# Altium schematic sheet Tilt-Power.SchDoc
size A3; Author: Yaokun/Felix Zhang; Organization: Altium Limited; Address1: 21A144; Address2: Harbin Engineering University; Address3: Harbin; Address4: CHINA
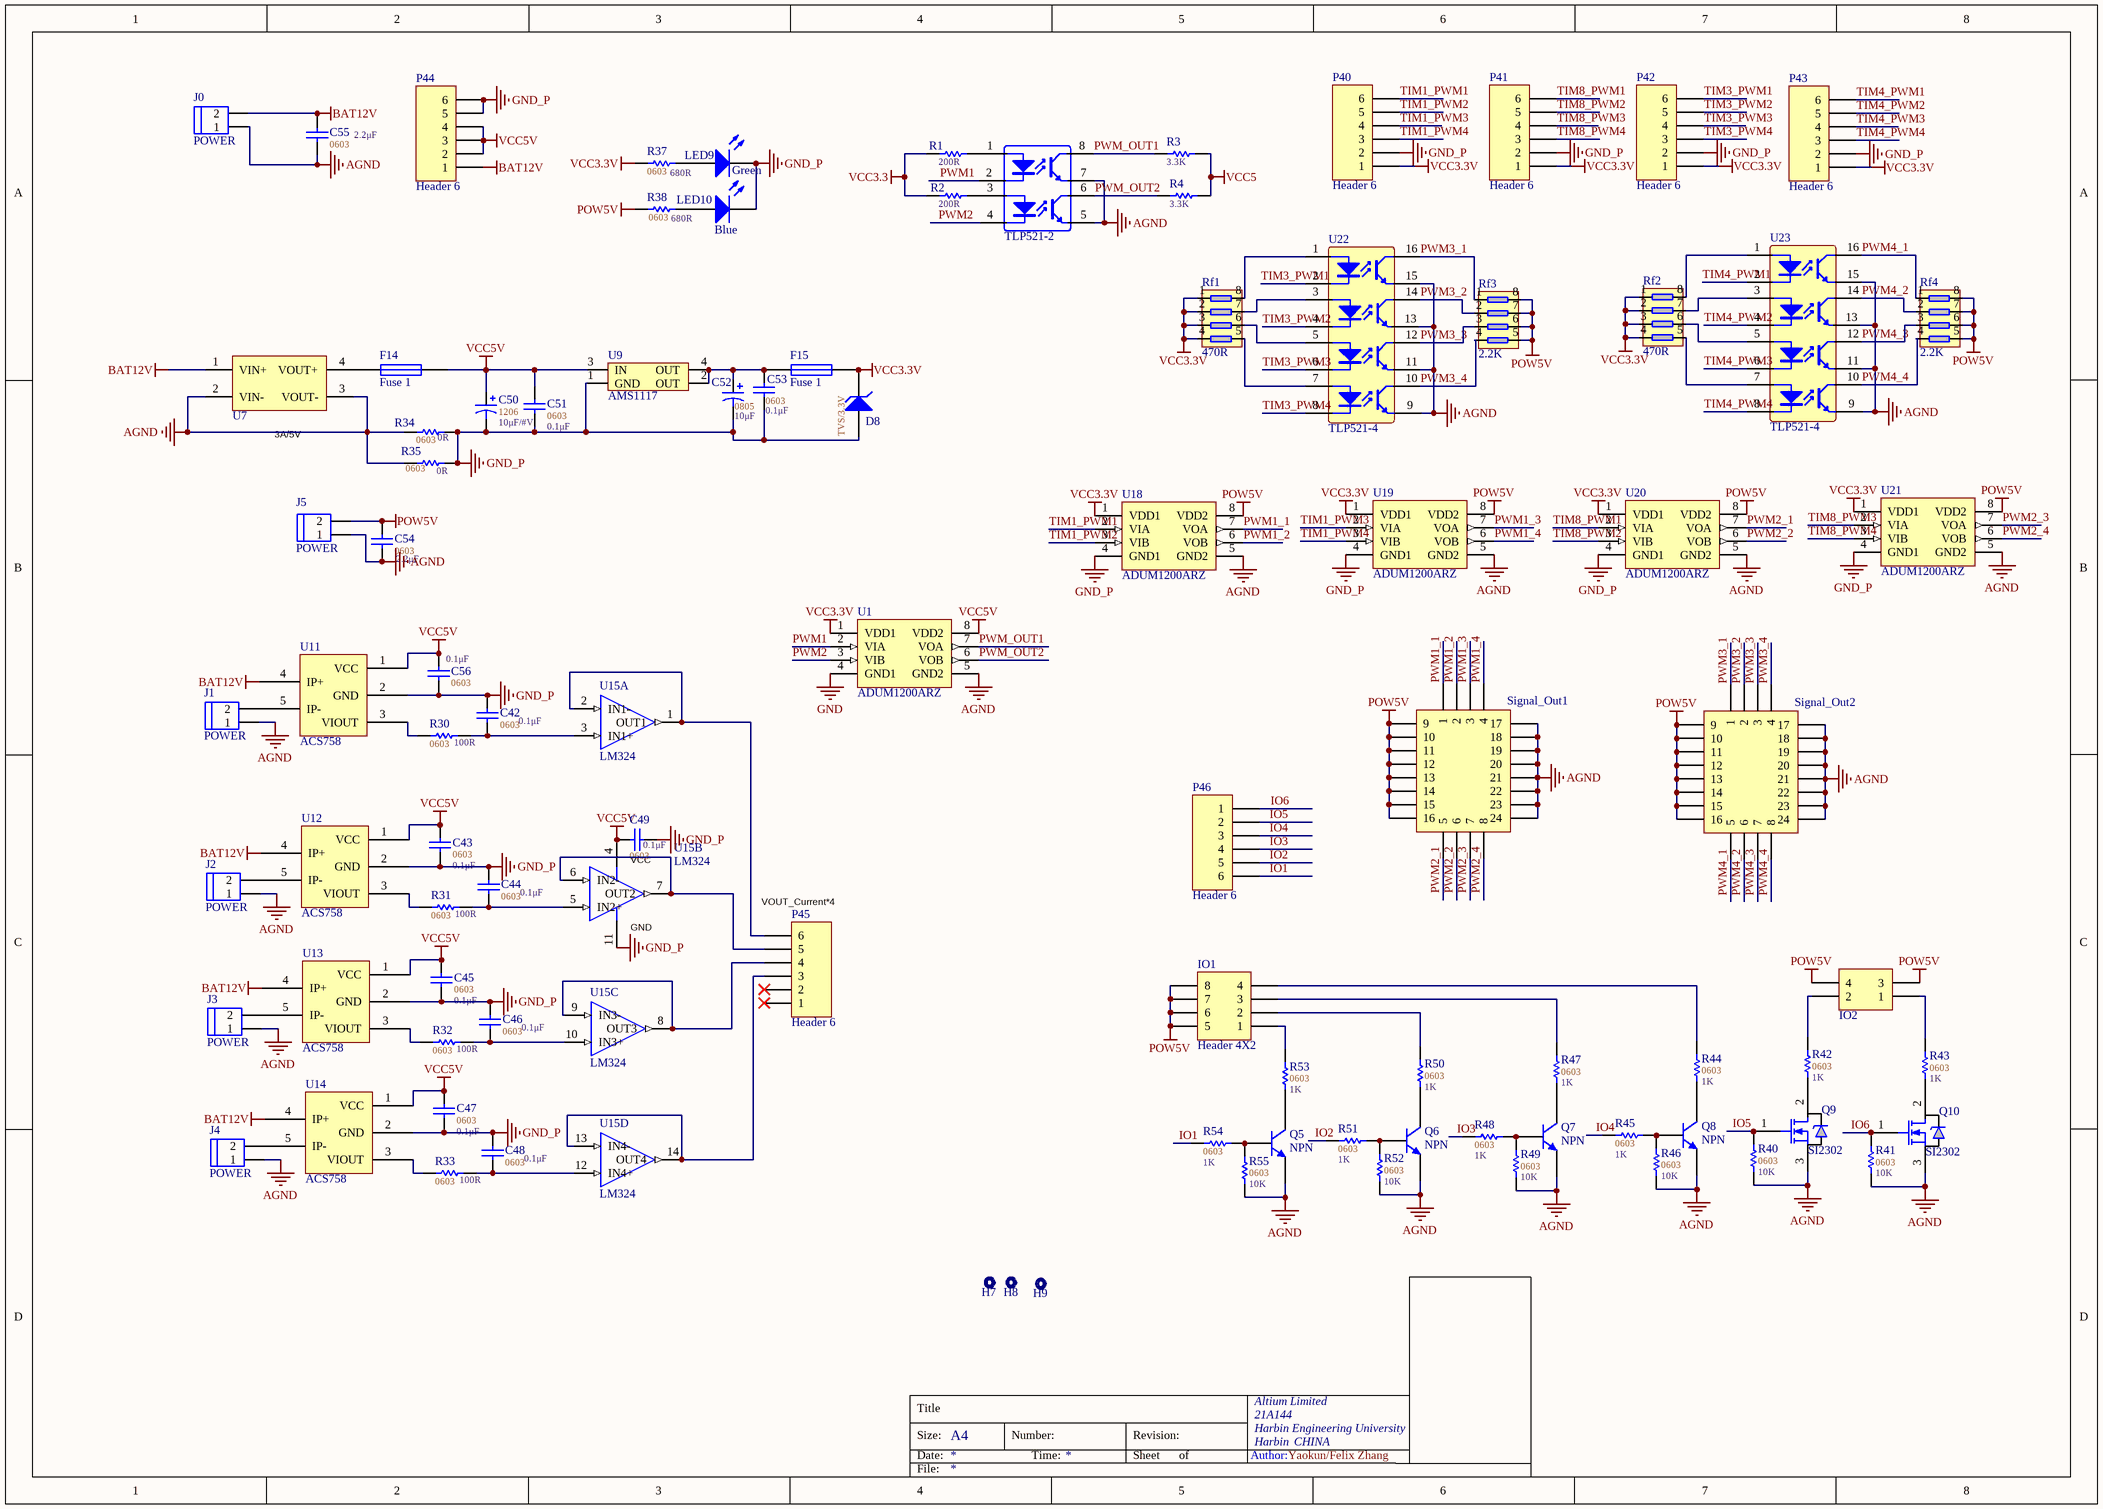
[diagram p0: Tilt-Power.SchDoc]

## Parts
*  TLP521-2
C42  value 0.1μF  [CAP_0603_16*08]  (hidden comment: 0603)
C43  value 0.1μF  [CAP_0603_16*08]  (hidden comment: 0603)
C44  value 0.1μF  [CAP_0603_16*08]  (hidden comment: 0603)
C45  value 0.1μF  [CAP_0603_16*08]  (hidden comment: 0603)
C46  value 0.1μF  [CAP_0603_16*08]  (hidden comment: 0603)
C47  value 0.1μF  [CAP_0603_16*08]  (hidden comment: 0603)
C48  value 0.1μF  [CAP_0603_16*08]  (hidden comment: 0603)
C49  value 0.1μF  [CAP_0603_16*08]  (hidden comment: 0603)
C50  value 10μF/#V  PackageReference: 1206  [CAP_1206]  (hidden comment: Polar)
C51  value 0.1μF  [CAP_0603_16*08]  (hidden comment: 0603)
C52  value 10μF  PackageReference: 0805  [CAP_0805_20*12]  (hidden comment: Polar)
C53  value 0.1μF  [CAP_0603_16*08]  (hidden comment: 0603)
C54  value 2.2μF  [CAP_0805_20*12]  (hidden comment: 0603)
C55  value 2.2μF  [CAP_0805_20*12]  (hidden comment: 0603)
C56  value 0.1μF  [CAP_0603_16*08]  (hidden comment: 0603)
D8  TVS/3.3V  [SOD523]
F14  Fuse 1  [FUSE3.5*5.5]
F15  Fuse 1  [RES_0805_20*12]
H7  pad  [PAD_M2]  (value not drawn)
H8  pad  [PAD_M2]  (value not drawn)
H9  pad  [PAD_M2]  (value not drawn)
IO1  Header 4X2  [HEADER2*4_PIN]
IO2  Header 2X2  [HEADER2*2_PIN]  (value not drawn)
J0  POWER  [POWER_PADS]
J1  POWER  [POWER_PADS]
J2  POWER  [POWER_PADS]
J3  POWER  [POWER_PADS]
J4  POWER  [POWER_PADS]
J5  POWER  [POWER_PADS]
LED9  Green  [LED0603]
LED10  Blue  [LED0603]
P40  Header 6  [Modolex_6P]
P41  Header 6  [Modolex_6P]
P42  Header 6  [Modolex_6P]
P43  Header 6  [Modolex_6P]
P44  Header 6  [Modolex_6P]
P45  Header 6  [Modolex_6P]
P46  Header 6  [Modolex_6P]
Q5  NPN  [SOT23_J3Y]
Q6  NPN  [SOT23_J3Y]
Q7  NPN  [SOT23_J3Y]
Q8  NPN  [SOT23_J3Y]
Q9  SI2302  [SOT-23_MOSN]
Q10  SI2302  [SOT-23_MOSN]
R1  value 200R  [RES_0402_10*06]  (hidden comment: SMD)
R2  value 200R  [RES_0402_10*06]  (hidden comment: SMD)
R3  value 3.3K  [RES_0402_10*06]  (hidden comment: SMD)
R4  value 3.3K  [RES_0402_10*06]  (hidden comment: SMD)
R30  value 100R  PackageReference: 0603  [RES_0603_16*08]  (hidden comment: SMD)
R31  value 100R  PackageReference: 0603  [RES_0603_16*08]  (hidden comment: SMD)
R32  value 100R  PackageReference: 0603  [RES_0603_16*08]  (hidden comment: SMD)
R33  value 100R  PackageReference: 0603  [RES_0603_16*08]  (hidden comment: SMD)
R34  value 0R  PackageReference: 0603  [RES_1206]  (hidden comment: SMD)
R35  value 0R  PackageReference: 0603  [RES_1206]  (hidden comment: SMD)
R37  value 680R  PackageReference: 0603  [RES_0603_16*08]  (hidden comment: SMD)
R38  value 680R  PackageReference: 0603  [RES_0603_16*08]  (hidden comment: SMD)
R40  value 10K  PackageReference: 0603  [RES_0603_16*08]  (hidden comment: SMD)
R41  value 10K  PackageReference: 0603  [RES_0603_16*08]  (hidden comment: SMD)
R42  value 1K  PackageReference: 0603  [RES_0603_16*08]  (hidden comment: SMD)
R43  value 1K  PackageReference: 0603  [RES_0603_16*08]  (hidden comment: SMD)
R44  value 1K  PackageReference: 0603  [RES_0603_16*08]  (hidden comment: SMD)
R45  value 1K  PackageReference: 0603  [RES_0603_16*08]  (hidden comment: SMD)
R46  value 10K  PackageReference: 0603  [RES_0603_16*08]  (hidden comment: SMD)
R47  value 1K  PackageReference: 0603  [RES_0603_16*08]  (hidden comment: SMD)
R48  value 1K  PackageReference: 0603  [RES_0603_16*08]  (hidden comment: SMD)
R49  value 10K  PackageReference: 0603  [RES_0603_16*08]  (hidden comment: SMD)
R50  value 1K  PackageReference: 0603  [RES_0603_16*08]  (hidden comment: SMD)
R51  value 1K  PackageReference: 0603  [RES_0603_16*08]  (hidden comment: SMD)
R52  value 10K  PackageReference: 0603  [RES_0603_16*08]  (hidden comment: SMD)
R53  value 1K  PackageReference: 0603  [RES_0603_16*08]  (hidden comment: SMD)
R54  value 1K  PackageReference: 0603  [RES_0603_16*08]  (hidden comment: SMD)
R55  value 10K  PackageReference: 0603  [RES_0603_16*08]  (hidden comment: SMD)
Rf1  470R  [RES_FOUR_0603]
Rf2  470R  [RES_FOUR_0603]
Rf3  2.2K  [RES_FOUR_0603]
Rf4  2.2K  [RES_FOUR_0603]
Signal_Out1  PWM  [HEADER3*8]  (value not drawn)
Signal_Out2  PWM  [HEADER3*8]  (value not drawn)
U1  ADUM1200ARZ  [SOIC-8]
U7  Voltage_Trans_Moduel  [3A_Moduel]  (value not drawn)
U9  AMS1117  [SOT223_M]
U11  ACS758  [ACS758]  (value not drawn)
U12  ACS758  [ACS758]  (value not drawn)
U13  ACS758  [ACS758]  (value not drawn)
U14  ACS758  [ACS758]  (value not drawn)
U15  LM324  [SOP-14N]  (parts A,B,C,D of 4)
U18  ADUM1200ARZ  [SOIC-8]
U19  ADUM1200ARZ  [SOIC-8]
U20  ADUM1200ARZ  [SOIC-8]
U21  ADUM1200ARZ  [SOIC-8]
U22  TLP521-4  [SOP16]
U23  TLP521-4  [SOP16]

## Nets
AGND: *.5 *.7 C54.1 C55.1 J0.1 J1.1 J2.1 J3.1 J4.1 J5.1 Q5.3(E) Q6.3(E) Q7.3(E) Q8.3(E) Q9.3(S) Q10.3(S) R34.1 R35.1 R40.1 R41.1 R46.1 R49.1 R52.1 R55.1 Signal_Out1.17 Signal_Out1.18 Signal_Out1.19 Signal_Out1.20 Signal_Out1.21 Signal_Out1.22 Signal_Out1.23 Signal_Out1.24 Signal_Out2.17 Signal_Out2.18 Signal_Out2.19 Signal_Out2.20 Signal_Out2.21 Signal_Out2.22 Signal_Out2.23 Signal_Out2.24 U1.5(GND2) U7.2(VIN-) U7.3(VOUT-) U18.5(GND2) U19.5(GND2) U20.5(GND2) U21.5(GND2) U22.9 U22.11 U22.13 U22.15 U23.9 U23.11 U23.13 U23.15
BAT12V: C55.2 J0.2 P44.1 U7.1(VIN+) U11.4(IP+) U12.4(IP+) U13.4(IP+) U14.4(IP+)
GND: U1.4(GND1)
GND_P: C42.2 C43.1 C44.2 C45.1 C46.2 C47.1 C48.2 C49.1 C50.2 C51.1 C52.2 C53.1 C56.1 D8.1(A) LED9.2(K) LED10.2(K) P40.2 P41.2 P42.2 P43.2 P44.5 P44.6 R34.2 R35.2 U9.1(GND) U11.2(GND) U12.2(GND) U13.2(GND) U14.2(GND) U15.11(GND) U18.4(GND1) U19.4(GND1) U20.4(GND1) U21.4(GND1)
POW5V: C54.2 IO1.5 IO1.6 IO1.7 IO1.8 IO2.3 IO2.4 J5.2 R38.1 Rf3.5 Rf3.6 Rf3.7 Rf3.8 Rf4.5 Rf4.6 Rf4.7 Rf4.8 Signal_Out1.9 Signal_Out1.10 Signal_Out1.11 Signal_Out1.12 Signal_Out1.13 Signal_Out1.14 Signal_Out1.15 Signal_Out1.16 Signal_Out2.9 Signal_Out2.10 Signal_Out2.11 Signal_Out2.12 Signal_Out2.13 Signal_Out2.14 Signal_Out2.15 Signal_Out2.16 U18.8(VDD2) U19.8(VDD2) U20.8(VDD2) U21.8(VDD2)
VCC3.3: R1.1 R2.1
VCC3.3V: D8.2(K) F15.2 P40.1 P41.1 P42.1 P43.1 R37.1 Rf1.1 Rf1.2 Rf1.3 Rf1.4 Rf2.1 Rf2.2 Rf2.3 Rf2.4 U1.1(VDD1) U18.1(VDD1) U19.1(VDD1) U20.1(VDD1) U21.1(VDD1)
VCC5: R3.2 R4.2
VCC5V: C43.2 C45.2 C47.2 C49.2 C50.1 C51.2 C56.2 F14.2 P44.2 P44.3 P44.4 U1.8(VDD2) U9.3(IN) U11.1(VCC) U12.1(VCC) U13.1(VCC) U14.1(VCC) U15.4(VCC)
IO1: P46.6 R54.1
IO2: P46.5 R51.1
IO3: P46.4 R48.1
IO4: P46.3 R45.1
IO5: P46.2 Q9.1(G) R40.2
IO6: P46.1 Q10.1(G) R41.2
PWM1: *.2 U1.2(VIA)
PWM1_1: Signal_Out1.1 U18.7(VOA)
PWM1_2: Signal_Out1.2 U18.6(VOB)
PWM1_3: Signal_Out1.3 U19.7(VOA)
PWM1_4: Signal_Out1.4 U19.6(VOB)
PWM2: *.4 U1.3(VIB)
PWM2_1: Signal_Out1.5 U20.7(VOA)
PWM2_2: Signal_Out1.6 U20.6(VOB)
PWM2_3: Signal_Out1.7 U21.7(VOA)
PWM2_4: Signal_Out1.8 U21.6(VOB)
PWM3_1: Rf3.1 Signal_Out2.1 U22.16
PWM3_2: Rf3.2 Signal_Out2.2 U22.14
PWM3_3: Rf3.3 Signal_Out2.3 U22.12
PWM3_4: Rf3.4 Signal_Out2.4 U22.10
PWM4_1: Rf4.1 Signal_Out2.5 U23.16
PWM4_2: Rf4.2 Signal_Out2.6 U23.14
PWM4_3: Rf4.3 Signal_Out2.7 U23.12
PWM4_4: Rf4.4 Signal_Out2.8 U23.10
PWM_OUT1: *.8 R3.1 U1.7(VOA)
PWM_OUT2: *.6 R4.1 U1.6(VOB)
TIM1_PWM1: P40.6 U18.2(VIA)
TIM1_PWM2: P40.5 U18.3(VIB)
TIM1_PWM3: P40.4 U19.2(VIA)
TIM1_PWM4: P40.3 U19.3(VIB)
TIM3_PWM1: P42.6 U22.2
TIM3_PWM2: P42.5 U22.4
TIM3_PWM3: P42.4 U22.6
TIM3_PWM4: P42.3 U22.8
TIM4_PWM1: P43.6 U23.2
TIM4_PWM2: P43.5 U23.4
TIM4_PWM3: P43.4 U23.6
TIM4_PWM4: P43.3 U23.8
TIM8_PWM1: P41.6 U20.2(VIA)
TIM8_PWM2: P41.5 U20.3(VIB)
TIM8_PWM3: P41.4 U21.2(VIA)
TIM8_PWM4: P41.3 U21.3(VIB)
Net*_1: *.1 R1.2
Net*_3: *.3 R2.2
NetC42_1: C42.1 R30.2 U15.3(IN1+)
NetC44_1: C44.1 R31.2 U15.5(IN2+)
NetC46_1: C46.1 R32.2 U15.10(IN3+)
NetC48_1: C48.1 R33.2 U15.12(IN4+)
NetC52_1: C52.1 C53.2 F15.1 U9.2(OUT) U9.4(OUT)
NetF14_1: F14.1 U7.4(VOUT+)
NetIO1_1: IO1.1 R53.2
NetIO1_2: IO1.2 R50.2
NetIO1_3: IO1.3 R47.2
NetIO1_4: IO1.4 R44.2
NetIO2_1: IO2.1 R43.2
NetIO2_2: IO2.2 R42.2
NetJ1_2: J1.2 U11.5(IP-)
NetJ2_2: J2.2 U12.5(IP-)
NetJ3_2: J3.2 U13.5(IP-)
NetJ4_2: J4.2 U14.5(IP-)
NetLED9_1: LED9.1(A) R37.2
NetLED10_1: LED10.1(A) R38.2
NetP45_3: P45.3 U15.13(IN4-) U15.14(OUT4)
NetP45_4: P45.4 U15.8(OUT3) U15.9(IN3-)
NetP45_5: P45.5 U15.6(IN2-) U15.7(OUT2)
NetP45_6: P45.6 U15.1(OUT1) U15.2(IN1-)
NetQ5_1: Q5.1(C) R53.1
NetQ5_2: Q5.2(B) R54.2 R55.2
NetQ6_1: Q6.1(C) R50.1
NetQ6_2: Q6.2(B) R51.2 R52.2
NetQ7_1: Q7.1(C) R47.1
NetQ7_2: Q7.2(B) R48.2 R49.2
NetQ8_1: Q8.1(C) R44.1
NetQ8_2: Q8.2(B) R45.2 R46.2
NetQ9_2: Q9.2(D) R42.1
NetQ10_2: Q10.2(D) R43.1
NetR30_1: R30.1 U11.3(VIOUT)
NetR31_1: R31.1 U12.3(VIOUT)
NetR32_1: R32.1 U13.3(VIOUT)
NetR33_1: R33.1 U14.3(VIOUT)
NetRf1_5: Rf1.5 U22.7
NetRf1_6: Rf1.6 U22.5
NetRf1_7: Rf1.7 U22.3
NetRf1_8: Rf1.8 U22.1
NetRf2_5: Rf2.5 U23.7
NetRf2_6: Rf2.6 U23.5
NetRf2_7: Rf2.7 U23.3
NetRf2_8: Rf2.8 U23.1

Not connected (* = marked no-connect by the designer): P45 1* 2*

## Notes on the sheet
- (near U7) 3A/5V
- (near P45) VOUT_Current*4
- Title
- Size:
- Date:
- A4
- Number:
- Time:
- Revision:
- Sheet
- of
- Author:
- File:

## Library data of the parts
C42-C49 C51 C53-C56 = Cap: Capacitor; Published: 8-Jun-2000; LatestRevisionDate: 17-Jul-2002; LatestRevisionNote: Re-released for DXP Platform.; Publisher: Altium Limited; PackageDescription: 0603; PackageReference: 0603
C50 C52 = Cap Pol: Polarized Capacitor (Axial); LatestRevisionDate: 17-Jul-2002; LatestRevisionNote: Re-released for DXP Platform.; Publisher: Altium Limited; Published: 1206; PackageDescription: Polar
D8 = D Zener: Zener Diode; Published: 8-Jun-2000; LatestRevisionDate: 17-Jul-2002; LatestRevisionNote: Re-released for DXP Platform.; PackageReference: DIODE-0.7; Publisher: Altium Limited; PackageDescription: Diode, Thru-Hole; 2 Leads; 0.7 in Pin Spacing
F14 F15 = Fuse 1: Fuse; Published: 8-Jun-2000; LatestRevisionDate: 17-Jul-2002; LatestRevisionNote: Re-released for DXP Platform.; PackageReference: PIN-W2/E2.8; Publisher: Altium Limited; PackageDescription: Thru-Hole; 2 Leads
IO1 = Header 4X2: Header, 4-Pin, Dual row; LatestRevisionDate: 17-Jul-2002; LatestRevisionNote: Re-released for DXP Platform.; Publisher: Altium Limited
IO2 = Header 2X2: Header, 2-Pin, Dual row; LatestRevisionDate: 17-Jul-2002; LatestRevisionNote: Re-released for DXP Platform.; Publisher: Altium Limited
J0-J5 = HEAD2
LED9 LED10 = LED: Typical RED, GREEN, YELLOW, AMBER GaAs LED; Published: 8-Jun-2000; LatestRevisionDate: 17-Jul-2002; LatestRevisionNote: Re-released for DXP Platform.; PackageVersion: Feb-2002; PackageReference: 3.2X1.6X1.1; Publisher: Altium Limited; PackageDescription: SM LED; 2 Flat Leads
P40-P46 = Header 6: Header, 6-Pin; LatestRevisionDate: 17-Jul-2002; LatestRevisionNote: Re-released for DXP Platform.; Publisher: Altium Limited
Q5-Q8 = NPN: NPN Bipolar Transistor; Published: 8-Jun-2000; LatestRevisionDate: 17-Jul-2002; LatestRevisionNote: Re-released for DXP Platform.; PackageReference: TO-226-AA; Publisher: Altium Limited; PackageDescription: TO, Flat Index; 3 In-Line, Axial Leads; Body Dia. 4.8mm; Leads 0.55 x 0.51 mm (max); Code_JEDEC: TO-226-AA
Q9 Q10 = MOSFET-N: N-Channel MOSFET; Published: 8-Jun-2000; LatestRevisionDate: 17-Jul-2002; LatestRevisionNote: Re-released for DXP Platform.; PackageVersion: 1995/1996; PackageReference: E3; Publisher: Altium Limited; PackageDescription: TO, Flat Index; 3 In-Line, Axial Leads; Body Dia. 4.6mm; Lead Dia. 0.5 mm (max)
R1-R4 R30-R35 R37 R38 R40-R55 = RES_SMD: Resistor; Published: 8-Jun-2000; LatestRevisionDate: 17-Jul-2002; LatestRevisionNote: Re-released for DXP Platform.; Publisher: Altium Limited; PackageDescription: SMD
  R1-R4: PackageReference: 0603
Rf1-Rf4 = RES_4P
Signal_Out1 Signal_Out2 = HEADER8*3
U1 U18-U21 = ADUM1200ARZ: ADUM1200